# Altium project Control_Board_Model_C201.PrjPcb (part 8 of 8)

## Sheet Logic_IO_Unit_V2.SchDoc: Logic IO System
size A4; DocumentNumber: 12; SheetNumber: 12; SheetTotal: 50
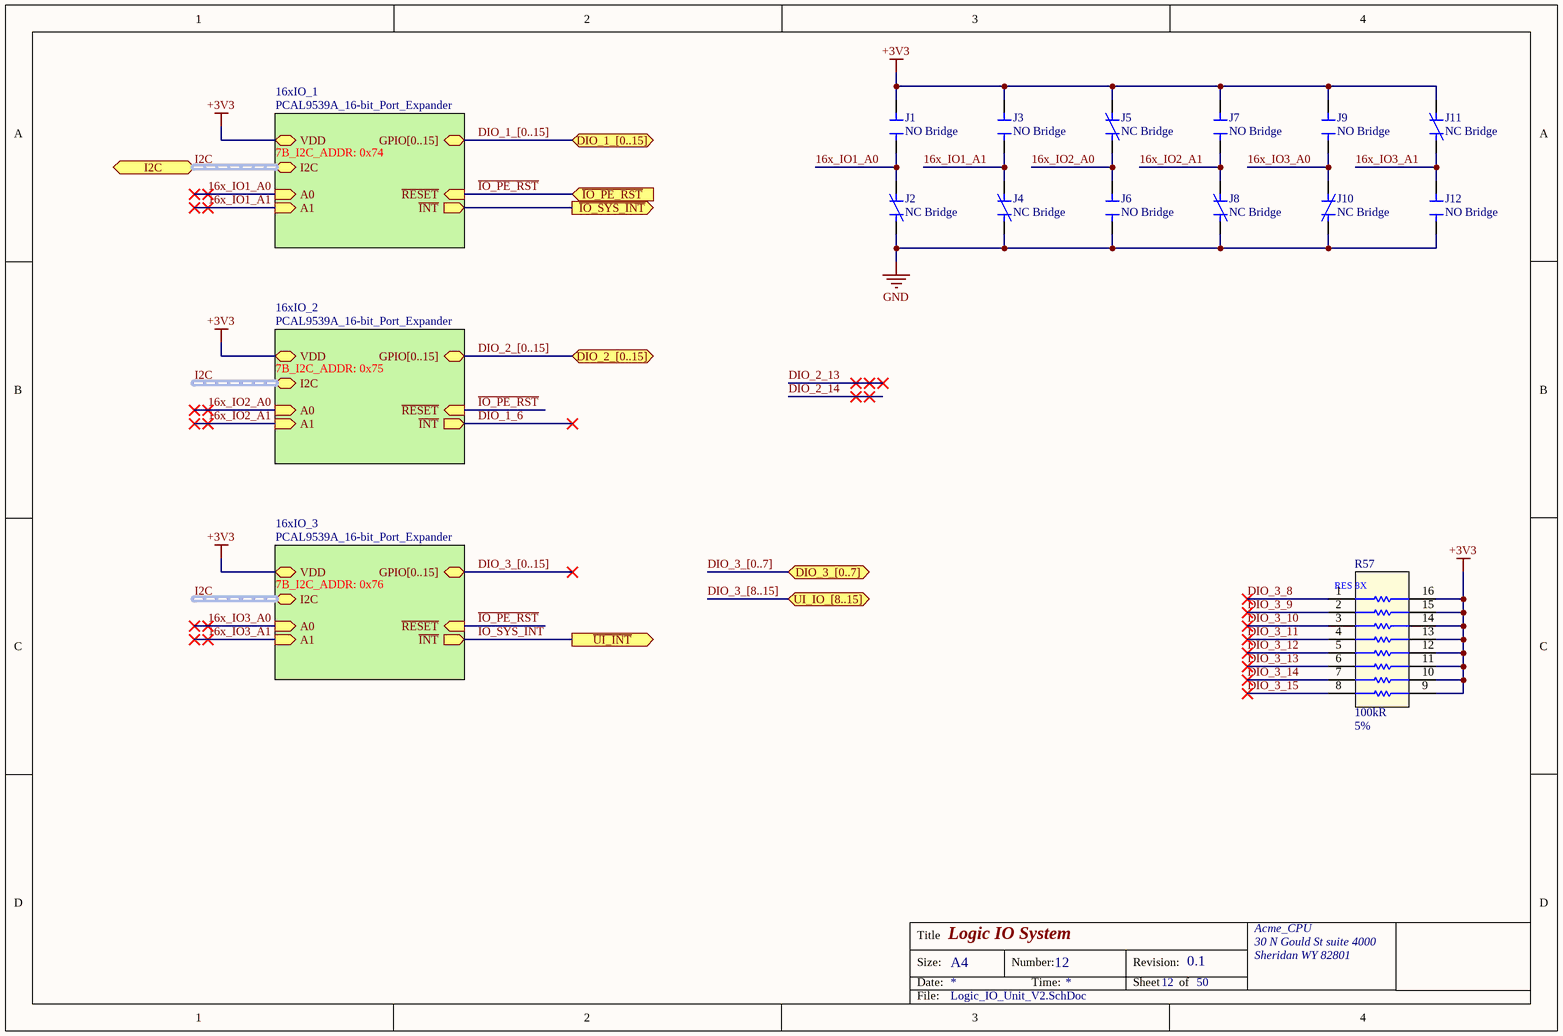
[diagram p18: Logic_IO_Unit_V2.SchDoc]

### Parts
J1  NO Bridge  [NO_SolderBridge_0603]  (no BOM)
J2  NC Bridge  [NC_SolderBridge_0603]  (net tie, no BOM)
J3  NO Bridge  [NO_SolderBridge_0603]  (no BOM)
J4  NC Bridge  [NC_SolderBridge_0603]  (net tie, no BOM)
J5  NC Bridge  [NC_SolderBridge_0603]  (net tie, no BOM)
J6  NO Bridge  [NO_SolderBridge_0603]  (no BOM)
J7  NO Bridge  [NO_SolderBridge_0603]  (no BOM)
J8  NC Bridge  [NC_SolderBridge_0603]  (net tie, no BOM)
J9  NO Bridge  [NO_SolderBridge_0603]  (no BOM)
J10  NC Bridge  [NC_SolderBridge_0603]  (net tie, no BOM)
J11  NC Bridge  [NC_SolderBridge_0603]  (net tie, no BOM)
J12  NO Bridge  [NO_SolderBridge_0603]  (no BOM)
R57  Resistance: 100kR  Tolerance: 5%  [YAG_YC248]  (hidden comment: RES ARRAY 8 RES 100K OHM 1606)

### Sub-sheets
16xIO_1 = PCAL9539A_16-bit_Port_Expander (file not in this document): GPIO[0..15] (bidir), A0 (in), A1 (in), ~{RESET} (in), VDD, I2C (harness I2C), ~{INT} (out)  | 7B_I2C_ADDR: 0x74
16xIO_2 = PCAL9539A_16-bit_Port_Expander (file not in this document): GPIO[0..15] (bidir), A0 (in), A1 (in), ~{RESET} (in), VDD, I2C (harness I2C), ~{INT} (out)  | 7B_I2C_ADDR: 0x75
16xIO_3 = PCAL9539A_16-bit_Port_Expander (file not in this document): GPIO[0..15] (bidir), A0 (in), A1 (in), ~{RESET} (in), VDD, I2C (harness I2C), ~{INT} (out)  | 7B_I2C_ADDR: 0x76

### Ports
DIO_1_[0..15] (bidir), DIO_2_[0..15] (bidir), DIO_3_[0..7] (bidir), I2C (harness I2C), UI_IO_[8..15] (bidir), ~{IO_PE_RST} (in), ~{IO_SYS_INT} (out), ~{UI_INT} (out)

### Nets
+3V3: J1.2 J3.2 J5.2 J7.2 J9.2 J11.2 R57.9 R57.10 R57.11 R57.12 R57.13 R57.14 R57.15 R57.16 ; sheet 16xIO_1/VDD, sheet 16xIO_2/VDD, sheet 16xIO_3/VDD
GND: J2.1 J4.1 J6.1 J8.1 J10.1 J12.1
16x_IO1_A0: J1.1 J2.2 ; sheet 16xIO_1/A0
16x_IO1_A1: J3.1 J4.2 ; sheet 16xIO_1/A1
16x_IO2_A0: J5.1 J6.2 ; sheet 16xIO_2/A0
16x_IO2_A1: J7.1 J8.2 ; sheet 16xIO_2/A1
16x_IO3_A0: J9.1 J10.2 ; sheet 16xIO_3/A0
16x_IO3_A1: J11.1 J12.2 ; sheet 16xIO_3/A1
~{INT0}: port ~{IO_SYS_INT}, sheet 16xIO_1/~{INT}
~{IO_PE_RST}: port ~{IO_PE_RST}, sheet 16xIO_1/~{RESET}, sheet 16xIO_2/~{RESET}, sheet 16xIO_3/~{RESET}
~{IO_SYS_INT}: port ~{UI_INT}, sheet 16xIO_3/~{INT}
DIO_1_6: sheet 16xIO_2/~{INT}
DIO_3_8: R57.1
DIO_3_9: R57.2
DIO_3_10: R57.3
DIO_3_11: R57.4
DIO_3_12: R57.5
DIO_3_13: R57.6
DIO_3_14: R57.7
DIO_3_15: R57.8

### Buses and harness runs
bus DIO_1_[0..15] = port DIO_1_[0..15] = sheet 16xIO_1/GPIO[0..15]
bus DIO_2_[0..15] = port DIO_2_[0..15] = sheet 16xIO_2/GPIO[0..15]
bus DIO_3_[0..7] = port DIO_3_[0..7]
bus DIO_3_[0..15] = sheet 16xIO_3/GPIO[0..15]
bus DIO_3_[8..15] = port UI_IO_[8..15]
harness I2C = port I2C = sheet 16xIO_1/I2C
harness I2C = sheet 16xIO_2/I2C
harness I2C = sheet 16xIO_3/I2C

### Notes on the sheet
- Title
- Size:
- Date:
- A4
- Number:
- Time:
- Revision:
- Sheet
- of
- File:
- (in symbol RES ARRAY 8 RES 100K OHM 1606) RES 8X

### Library data of the parts
J1 J3 J6 J7 J9 J12 = NO Bridge: NO PCB Bridge (May be closed by a solder blob)
  J1 J3: ClassName: 16xIO_1
  J6 J7: ClassName: 16xIO_2
  J9 J12: ClassName: 16xIO_3
J2 J4 J5 J8 J10 J11 = NC Bridge: NC PCB Bridge (May be opened by cutting the copper trace)
  J2 J4: ClassName: 16xIO_1
  J5 J8: ClassName: 16xIO_2
  J10 J11: ClassName: 16xIO_3
R57 = RES ARRAY 8 RES 100K OHM 1606: 100k Ohm ±5% 62.5mW Power Per Element Isolated  Resistor Network/Array ±200ppm/°C 1606, Convex, Long Side Terminals; Manufacturer: Yageo; Manufacturer Part Number: YC248-JR-07100KL; Number of Resistors: 8; Number of Contacts: 16; Voltage Rating: 50V; Supplier 1: Digi-Key; Stock 1: 5800; Pricing 1: 1=0.3, 10=0.251, 25=0.1828, 50=0.1324, 100=0.0982, 250=0.0754, 500=0.0594, 1000=0.0411 (USD); Mount: Surface Mount; Case/Package: 0616; Number of Pins: 16; Number of Terminals: 16; Case Code (Metric): 1640; Case Code (Imperial): 0616; Min Operating Temperature: -55°C; Max Operating Temperature: 155°C; Temperature Coefficient: 200ppm/°C; Power Rating: 62.5mW; Number of Circuits: 8; Number of Elements: 8; Package Quantity: 1; Packaging: Tape and Reel; Circuit Type: Isolated; Power Per Element: 62.5mW; Military Standard: Not; Termination: Convex; Length: 0.157inch; Height: 0.022inch; Width: 0.063inch; Terminal Pitch: 0.5mm; Depth: 1.6mm; REACH SVHC: No SVHC; Lead Free: Lead Free; ComponentLink1URL: https://media.digikey.com/pdf/Data%20Sheets/Yageo%20PDFs/YC102-358,TC122-164_Series_DS.pdf?src-supplier=Digi-Key; ComponentLink1Description: https://media.digikey.com/pdf/Data%20Sheets/Yageo%20PDFs/YC102-358,TC122-164_Series_DS.pdf?src-supplier=Digi-Key; ComponentLink2URL: http://www.yageo.com/documents/recent/PYu-YC248_51_RoHS_L_2.pdf?src-supplier=Digi-Key; ComponentLink2Description: http://www.yageo.com/documents/recent/PYu-YC248_51_RoHS_L_2.pdf?src-supplier=Digi-Key; ComponentLink3URL: http://www.yageo.com/NewPortal/yageodocoutput?fileName=/pdf/R-Chip/PYu-YC_TC_group_51_RoHS_L_0.pdf&src-supplier=Digi-Key; ComponentLink3Description: http://www.yageo.com/NewPortal/yageodocoutput?fileName=/pdf/R-Chip/PYu-YC_TC_group_51_RoHS_L_0.pdf&src-supplier=Digi-Key; ComponentLink4URL: http://www.yageo.com/documents/recent/PYu-YC248_51_RoHS_L_(2).pdf?src-supplier=Avnet+Europe; ComponentLink4Description: http://www.yageo.com/documents/recent/PYu-YC248_51_RoHS_L_(2).pdf?src-supplier=Avnet+Europe; Supplier Part Number 1: YC248J-100KCT-ND; Voltage Rating (DC): 50V; Composition: Thick Film; Radiation Hardening: No; ComponentLink5URL: http://www.farnell.com/datasheets/443139.pdf?src-supplier=Element14; ComponentLink5Description: http://www.farnell.com/datasheets/443139.pdf?src-supplier=Element14; ClassName: 16xIO_3

## Sheet I2C_Bus_Multiplexer.SchDoc: I2C Bus Multiplexer
size A4; DocumentNumber: 11; SheetNumber: 11; SheetTotal: 50
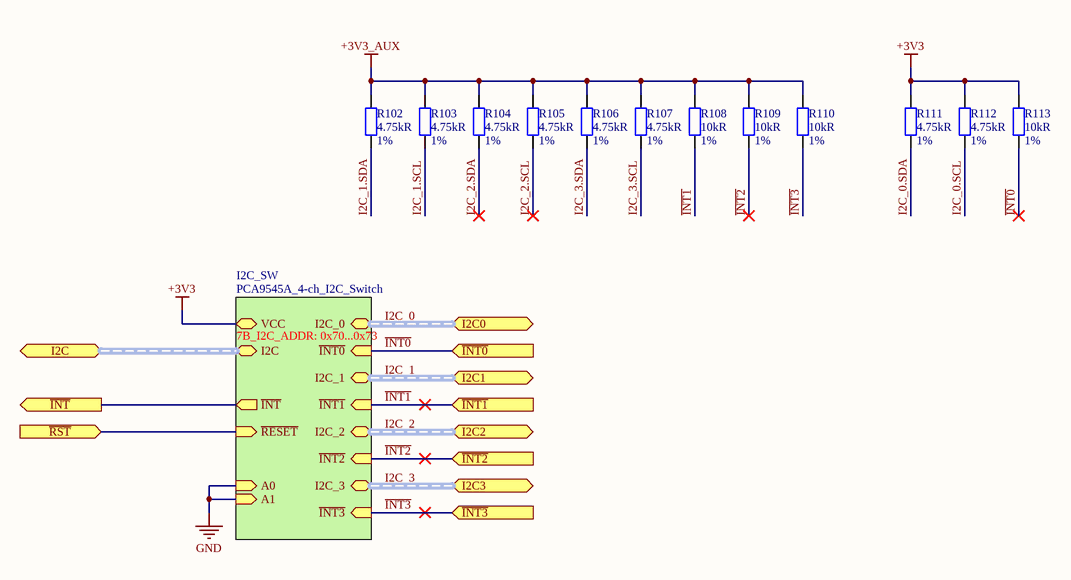
[diagram p19: I2C_Bus_Multiplexer.SchDoc]

### Parts
R102  Resistance: 4.75kR  Tolerance: 1%  [R0402]  (hidden comment: RES SMD 4.75K OHM 1% 1/16W 0402)
R103  Resistance: 4.75kR  Tolerance: 1%  [R0402]  (hidden comment: RES SMD 4.75K OHM 1% 1/16W 0402)
R104  Resistance: 4.75kR  Tolerance: 1%  [R0402]  (hidden comment: RES SMD 4.75K OHM 1% 1/16W 0402)
R105  Resistance: 4.75kR  Tolerance: 1%  [R0402]  (hidden comment: RES SMD 4.75K OHM 1% 1/16W 0402)
R106  Resistance: 4.75kR  Tolerance: 1%  [R0402]  (hidden comment: RES SMD 4.75K OHM 1% 1/16W 0402)
R107  Resistance: 4.75kR  Tolerance: 1%  [R0402]  (hidden comment: RES SMD 4.75K OHM 1% 1/16W 0402)
R108  Resistance: 10kR  Tolerance: 1%  [R0402]  (hidden comment: RES SMD 10K OHM 1% 1/16W 0402)
R109  Resistance: 10kR  Tolerance: 1%  [R0402]  (hidden comment: RES SMD 10K OHM 1% 1/16W 0402)
R110  Resistance: 10kR  Tolerance: 1%  [R0402]  (hidden comment: RES SMD 10K OHM 1% 1/16W 0402)
R111  Resistance: 4.75kR  Tolerance: 1%  [R0402]  (hidden comment: RES SMD 4.75K OHM 1% 1/16W 0402)
R112  Resistance: 4.75kR  Tolerance: 1%  [R0402]  (hidden comment: RES SMD 4.75K OHM 1% 1/16W 0402)
R113  Resistance: 10kR  Tolerance: 1%  [R0402]  (hidden comment: RES SMD 10K OHM 1% 1/16W 0402)

### Sub-sheets
I2C_SW = PCA9545A_4-ch_I2C_Switch (file not in this document): A1 (in), VCC, A0 (in), ~{INT} (out), ~{RESET} (in), ~{INT0} (in), ~{INT1} (in), ~{INT2} (in), ~{INT3} (in), I2C (harness I2C), I2C_0 (harness I2C), I2C_3 (harness I2C), I2C_1 (harness I2C), I2C_2 (harness I2C)  | 7B_I2C_ADDR: 0x70...0x73

### Ports
I2C0 (harness I2C), I2C1 (harness I2C), I2C2 (harness I2C), I2C3 (harness I2C), I2C (harness I2C), ~{INT0} (in), ~{INT1} (in), ~{INT2} (in), ~{INT3} (in), ~{INT} (out), ~{RST} (in)

### Nets
+3V3: R111.2 R112.2 R113.1 ; sheet I2C_SW/VCC
+3V3_AUX: R102.2 R103.2 R104.2 R105.2 R106.2 R107.2 R108.1 R109.1 R110.1
GND: sheet I2C_SW/A1, sheet I2C_SW/A0
~{INT0}: R113.2 ; port ~{INT0}, sheet I2C_SW/~{INT0}
~{INT1}: R108.2 ; port ~{INT1}, sheet I2C_SW/~{INT1}  [project net ~{I2C_S1_INT}]
~{INT2}: R109.2 ; port ~{INT2}, sheet I2C_SW/~{INT2}  [project net ~{I2C_S2_INT}]
~{INT3}: R110.2 ; port ~{INT3}, sheet I2C_SW/~{INT3}  [project net ~{I2C_S3_INT}]
~{IO_PE_RST}: port ~{RST}, sheet I2C_SW/~{RESET}
~{SENS_INT}: port ~{INT}, sheet I2C_SW/~{INT}
I2C_0.SCL: R112.1
I2C_0.SDA: R111.1
I2C_1.SCL: R103.1
I2C_1.SDA: R102.1
I2C_2.SCL: R105.1
I2C_2.SDA: R104.1
I2C_3.SCL: R107.1
I2C_3.SDA: R106.1

### Buses and harness runs
harness I2C_0 = port I2C0 = sheet I2C_SW/I2C_0
harness I2C_1 = port I2C1 = sheet I2C_SW/I2C_1
harness I2C_2 = port I2C2 = sheet I2C_SW/I2C_2
harness I2C_3 = port I2C3 = sheet I2C_SW/I2C_3
harness port I2C = sheet I2C_SW/I2C

### Notes on the sheet
- Title
- Size:
- Date:
- A4
- Number:
- Time:
- Revision:
- Sheet
- of
- File:

### Library data of the parts
R102-R107 R111 R112 = RES SMD 4.75K OHM 1% 1/16W 0402: 4.75 kOhms ±1% 0.063W, 1/16W Chip Resistor 0402 (1005 Metric) Moisture Resistant Thick Film; Manufacturer: Yageo; Manufacturer Part Number: RC0402FR-074K75P; Max Power Dissipation: 63mW; Temperature Coefficient: 150ppm/°C; Case/Package: 0402; Supplier 1: Digi-Key; Stock 1: 23485; Pricing 1: 1=0.1, 10=0.035, 100=0.014, 1000=0.0063, 2500=0.0055, 5000=0.0045 (USD); Case Code (Metric): 1005; Case Code (Imperial): 0402; Min Operating Temperature: -55°C; Max Operating Temperature: 155°C; Packaging: Tape and Reel; Composition: Thick Film; Number of Terminations: 2; Features: Moisture Resistant; Length: 0.039inch; Height: 0.016inch; Width: 0.02inch; ComponentLink1URL: http://www.yageo.com/NewPortal/yageodocoutput?fileName=/pdf/R-Chip/PYu-RC_51_RoHS_P_0.pdf&src-supplier=Digi-Key; ComponentLink1Description: http://www.yageo.com/NewPortal/yageodocoutput?fileName=/pdf/R-Chip/PYu-RC_51_RoHS_P_0.pdf&src-supplier=Digi-Key; ComponentLink2URL: http://www.yageo.com.tw/exep/pages/download/literatures/PYu-R_INT-thick_7.pdf?src-supplier=Digi-Key; ComponentLink2Description: http://www.yageo.com.tw/exep/pages/download/literatures/PYu-R_INT-thick_7.pdf?src-supplier=Digi-Key; Supplier Part Number 1: YAG1271CT-ND; ClassName: I2C_SW; Mount: Surface Mount
R108-R110 R113 = RES SMD 10K OHM 1% 1/16W 0402: as R80 on sheet BG95_Broadband_Modem; Case/Package: 0402; Supplier 1: Digi-Key; Stock 1: 839368; Pricing 1: 1=0.1, 10=0.035, 100=0.014, 1000=0.0063, 2500=0.0055, 5000=0.0045 (USD); Case Code (Metric): 1005; Case Code (Imperial): 0402; Min Operating Temperature: -55°C; Max Operating Temperature: 155°C; Packaging: Tape and Reel; Composition: Thick Film; Number of Terminations: 2; Features: Moisture Resistant; Length: 0.039inch; Height: 0.016inch; Width: 0.02inch; ComponentLink1URL: http://www.yageo.com/NewPortal/yageodocoutput?fileName=/pdf/R-Chip/PYu-RC_51_RoHS_P_0.pdf&src-supplier=Digi-Key; ComponentLink1Description: http://www.yageo.com/NewPortal/yageodocoutput?fileName=/pdf/R-Chip/PYu-RC_51_RoHS_P_0.pdf&src-supplier=Digi-Key; Supplier Part Number 1: YAG1249CT-ND; ClassName: I2C_SW; Mount: Surface Mount

## Sheet BMA253_Orientation_Sensor.SchDoc: BMA253 Orientation Sensor
size A4; DocumentNumber: 20; SheetNumber: 20; SheetTotal: 50
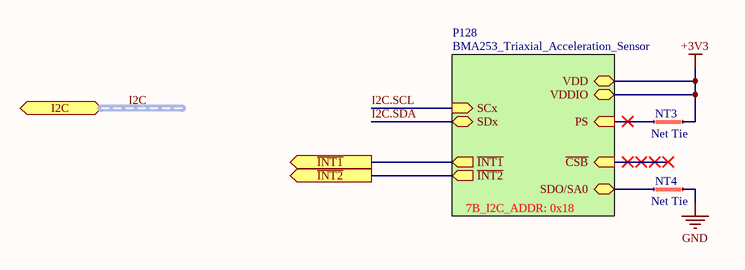
[diagram p20: BMA253_Orientation_Sensor.SchDoc]

### Parts
NT3  Net Tie  [Net Tie 6x30mil]  (net tie, no BOM)
NT4  Net Tie  [Net Tie 6x30mil]  (net tie, no BOM)

### Sub-sheets
P128 = BMA253_Triaxial_Acceleration_Sensor (file not in this document): ~{INT2} (out), ~{INT1} (out), SCx (in), SDO/SA0, ~{CSB} (in), PS (in), SDx (bidir), VDD, VDDIO  | 7B_I2C_ADDR: 0x18

### Ports
I2C (harness I2C), ~{INT1} (out), ~{INT2} (out)

### Nets
+3V3: NT3.2 ; sheet P128/VDD, sheet P128/VDDIO
GND: NT4.2
DIO_1_5: port ~{INT1}, sheet P128/~{INT1}
I2C.SCL: sheet P128/SCx
I2C.SDA: sheet P128/SDx
NetNT3_1: NT3.1 ; sheet P128/PS
NetNT4_1: NT4.1 ; sheet P128/SDO/SA0
(unnamed): port ~{INT2}, sheet P128/~{INT2}

### Buses and harness runs
harness I2C = port I2C

### Notes on the sheet
- Title
- Size:
- Date:
- A4
- Number:
- Time:
- Revision:
- Sheet
- of
- File:

### Library data of the parts
NT3 NT4 = Net Tie Line: ClassName: P128

## Nets that join several sheets
+1V8: Test_Points (TP15.1), Sensor Connection (R55.2 R56.2), BG95_VLT (C49.2 Q13.3 Q13.6)
+1V8_BG95: BG95_Power (C37.2 C38.2 U8.29), BG95_VLT (R96.1)
+3V3: USB_Type-C_Port_V2.0 (R4.1 R7.1 R9.1 R17.2), Test_Points (TP16.1), MCU_Module (14 pins), Motor Connection (6 pins), Sensor Connection (C23.1 C24.1 U4.5 U5.5), User_Interface (R58.1), ESP32_Module (6 pins), Logic_IO_Unit_V2 (14 pins), I2C_Bus_Multiplexer (R111.2 R112.2 R113.1), BMA253_Orientation_Sensor (NT3.2)
+3V3_AUX: Test_Points (TP14.1), Sensor Connection (C25.2 C26.2 P20.3 P28.3), I2C_Bus_Multiplexer (9 pins)
GND: USB_Type-C_Port_V2.0 (22 pins), Test_Points (7 pins), MCU_Module (BTN1.2), NX3215SA-32.768k_Crystall_Oscillator (C12.1 C13.1), Analog_Signal_Conditioner_V2 (8 pins), Motor Connection (10 pins), Sensor Connection (12 pins), bq25611d_Battery_Charger (18 pins), User_Interface (11 pins), Auxiliary (MNT1.1 MNT2.1 MNT3.1 MNT4.1), BG95_Broadband_Modem (10 pins), BG95_Misc (8 pins), BG95_Power (39 pins), BG95_RF (8 pins), BG95_VLT (9 pins), Logic_IO_Unit_V2 (6 pins), BMA253_Orientation_Sensor (NT4.2)
VBUS: USB_Type-C_Port_V2.0 (7 pins), Test_Points (TP19.1), Analog_Signal_Conditioner_V2 (R38.1), bq25611d_Battery_Charger (C4.2 U2.1 U2.24), BG95_Broadband_Modem (C31.1 R85.1 U9.5)
VFAN: Test_Points (TP13.1), Analog_Signal_Conditioner_V2 (R39.1), Motor Connection (C17.1 C18.1 C19.1 P16.2)
VSYS: Top_Control_Board_Model_C201 (R1.2), Test_Points (TP17.1), Motor Connection (5 pins), bq25611d_Battery_Charger (6 pins), User_Interface (7 pins), BG95_Broadband_Modem (5 pins)
~{BG95_PWRKEY}: BG95_Broadband_Modem (U8.15), BG95_VLT (C48.2 Q11.3)
~{BG95_RESET}: BG95_Broadband_Modem (U8.17), BG95_VLT (Q12.3)
~{I2C_S1_INT}: Sensor Connection (R53.1), I2C_Bus_Multiplexer (R108.2)
~{I2C_S3_INT}: Sensor Connection (R54.1), I2C_Bus_Multiplexer (R110.2)
~{IO_PE_RST}: MCU_Module (D6.2 R32.2), ESP32_Module (R67.1)
~{UI_BAT_EN}: bq25611d_Battery_Charger (U2.12), User_Interface (D10.1 U6.5)
BG95_PON_TRIG: BG95_Broadband_Modem (U8.96), BG95_VLT (Q13.4 R100.1)
BG95_USB_BOOT: BG95_Broadband_Modem (U8.75), BG95_VLT (Q13.1 R98.1)
CC1: USB_Type-C_Port_V2.0 (C1.2 Q1.6), MCU_Module (R35.1)
CC2: USB_Type-C_Port_V2.0 (C3.2 Q1.3), MCU_Module (R36.1)
DIO_3_8: User_Interface (U6.8), Logic_IO_Unit_V2 (R57.1)
DIO_3_9: User_Interface (U6.7), Logic_IO_Unit_V2 (R57.2)
DIO_3_10: User_Interface (U6.6), Logic_IO_Unit_V2 (R57.3)
DIO_3_11: User_Interface (D10.2), Logic_IO_Unit_V2 (R57.4)
DIO_3_12: User_Interface (U7.8), Logic_IO_Unit_V2 (R57.5)
DIO_3_13: User_Interface (U7.7), Logic_IO_Unit_V2 (R57.6)
DIO_3_14: User_Interface (U7.6), Logic_IO_Unit_V2 (R57.7)
DIO_3_15: User_Interface (U7.5), Logic_IO_Unit_V2 (R57.8)
NetD16_1: BG95_Broadband_Modem (FB1.1), BG95_Power (D16.1 FB2.2 FB3.2)
VBAT: Test_Points (TP18.1), Analog_Signal_Conditioner_V2 (Q2.4 R40.2), bq25611d_Battery_Charger (5 pins)

## Assembly variants
No_Broadband_TFT_SCREEN: not fitted C21 C22 C23 C24 C25 C26 C27 C28 C29 C30 C31 C32 C33 C34 C35 C36 C37 C38 C39 C57 C58 C59 C60 C65 C67 C68 C69 C70 C81 C82 C83 C84 C85 C86 C87 D12 D13 D14 D15 D16 D24 D25 FB1 FB2 FB3 L2 OLED Q3 Q4 Q5 Q6 Q7 Q8 Q9 R37 R38 R39 R40 R41 R42 R43 R44 R45 R46 R47 R48 R49 R50 R51 R52 R53 R54 R55 R56 R57 R58 R70 R71 R72 R73 R97 R98 R99 R110 R111 R113 TP25 TP26 U6 U7 U8 U9 U10 U14 U16 U18 U19 X6 X7; alternate parts U37 -> IC TSB711 OPAMP GP 1 CIRCUIT SOT-23-5
No_Broadband_OLED_SCREEN: not fitted C21 C22 C23 C24 C25 C26 C27 C28 C29 C30 C31 C32 C33 C34 C35 C36 C37 C38 C39 C57 C58 C59 C60 C65 C67 C68 C69 C70 C79 C80 D12 D13 D14 D15 D16 D20 D24 D25 FB1 FB2 FB3 L2 Q3 Q4 Q5 Q6 Q7 Q8 Q9 R37 R38 R39 R40 R41 R42 R43 R44 R45 R46 R47 R48 R49 R50 R51 R52 R53 R54 R55 R56 R57 R58 R70 R71 R72 R73 R97 R98 R99 R109 TFT TP25 TP26 U5 U6 U7 U8 U9 U10 U14 U16 U18 U19 X6 X7; alternate parts R112 -> RES SMD 1.47K OHM 1% 1/10W 0603, U37 -> IC TSB711 OPAMP GP 1 CIRCUIT SOT-23-5
BG95-M1_US_TFT_SCREEN: not fitted C57 C58 C59 C60 C81 C82 C83 C84 C85 C86 C87 L2 OLED R70 R71 R72 R73 R97 R98 R99 R110 R111 R113 U14; alternate parts U37 -> IC TSB711 OPAMP GP 1 CIRCUIT SOT-23-5
BG95-M1_US_OLED_SCREEN: not fitted C57 C58 C59 C60 C79 C80 D20 L2 R70 R71 R72 R73 R97 R98 R99 R109 TFT U5 U14; alternate parts R112 -> RES SMD 1.47K OHM 1% 1/10W 0603, U37 -> IC TSB711 OPAMP GP 1 CIRCUIT SOT-23-5
BG95-M3_Global_TFT_SCREEN: not fitted C81 C82 C83 C84 C85 C86 C87 FB1 OLED R70 R71 R72 R73 R110 R111 R113; alternate parts U37 -> IC TSB711 OPAMP GP 1 CIRCUIT SOT-23-5
BG95-M3_Global_OLED_SCREEN: not fitted C79 C80 D20 FB1 R70 R71 R72 R73 R109 TFT U5; alternate parts R112 -> RES SMD 1.47K OHM 1% 1/10W 0603, U37 -> IC TSB711 OPAMP GP 1 CIRCUIT SOT-23-5